# Altium schematic sheet 04_UserIO.SchDoc
size A
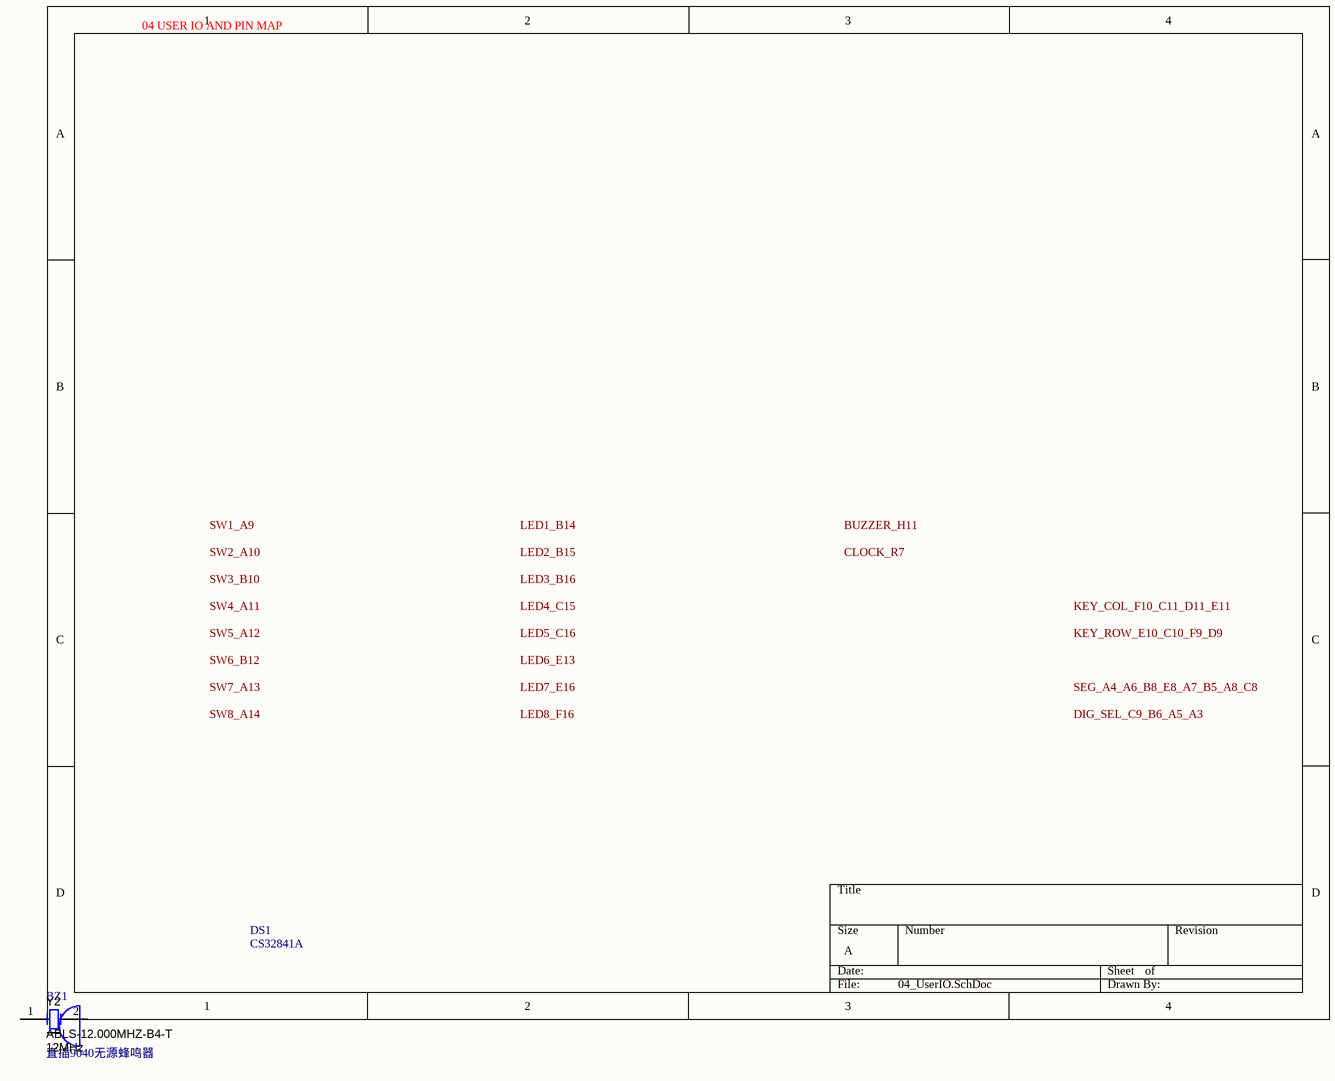
[diagram p0: 04_UserIO.SchDoc]

## Parts
BZ1  直插9040无源蜂鸣器  [BUZZER_9*9_4MM]
DS1  CS32841A  [CS2845AUR]
Y2  ABLS-12.000MHZ-B4-T  Frequency: 12MHz  [YQ_OSC5032]

## Nets

Not connected (* = marked no-connect by the designer): BZ1 1 2; Y2 1(OSC1) 2(OSC2)

## Notes on the sheet
- 04 USER IO AND PIN MAP
- Labels drawn without touching a wire or pin: BUZZER_H11, CLOCK_R7, DIG_SEL_C9_B6_A5_A3, KEY_COL_F10_C11_D11_E11, KEY_ROW_E10_C10_F9_D9, LED1_B14, LED2_B15, LED3_B16, LED4_C15, LED5_C16, LED6_E13, LED7_E16, LED8_F16, SEG_A4_A6_B8_E8_A7_B5_A8_C8, SW1_A9, SW2_A10, SW3_B10, SW4_A11, SW5_A12, SW6_B12, SW7_A13, SW8_A14

## Library data of the parts
BZ1 = BUZZER_EFBAA14D001: Buzzer, 74 dB min, 25V p-p, 8500pF @ 1kHz，直插9040无源蜂鸣器; Manufacturer: Panasonic; Area: 264,208; Value: {Value}; ComponentHeight: 0.276 inch; PackageReference: 0.550 DIA.; SymbolVersion: 07/31/2009 12:17:27; PartNumber: 直插9040无源蜂鸣器; ComponentLink1Description: AEO Datasheet Link
DS1 = 4LED-ANODE: 4位共阴数码管，红色
Y2 = ABLS-8.000MHZ-B4-T: Crystal, 12MHz, 18pF, SMD,无源; Manufacturer: Abracon Corportation; SymbolCreator: a0412235; U/M: EA; TaMin_C: 0; TaMax_C: 70; Frequency Stability: ±50ppm; SymbolVersion: 2008-07-09; PartNumber: ABLS-12.000MHZ-B4-T; CompType: Crystal; PackageReference: Crystal, 11.4x4.3x3.8mm; MountType: SMT; RoHS: Y; ComponentLink1Description: Datasheet Link; ComponentLink1URL: http://www.abracon.com/Resonators/abls.pdf; Publisher: Texas Instruments; LatestRevisionDate: 2015-05-05; Supplier 1: Digi-Key; Supplier Part Number 1: 535-10212-1-ND; Supplier 2: Mouser; Supplier Part Number 2: 815-ABLS-8.0M-T